# EAGLE design L293D Module (EAGLE 9.6.2)
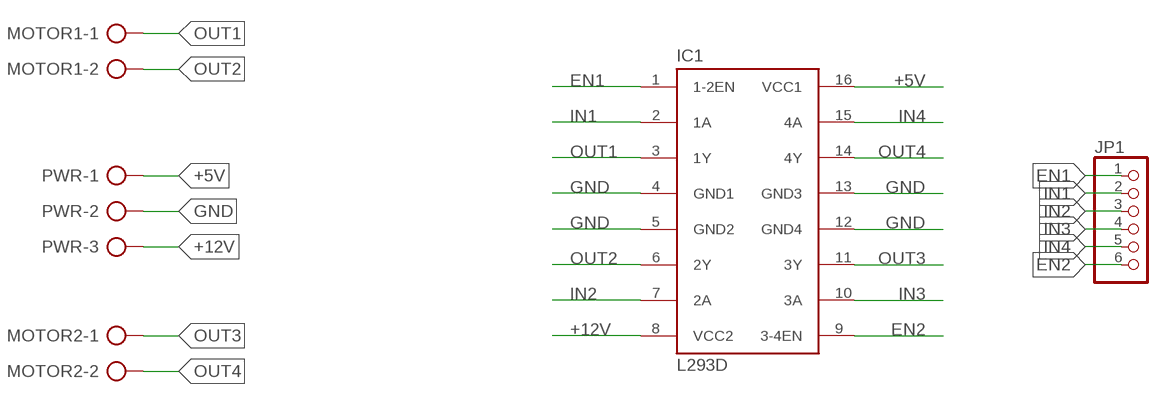
[diagram p0: schematic, sheet 1]

## Parts
IC1  L293D  [DIL16]
JP1  PINHD-1X6  [1X06]
MOTOR1  AK500/2-H  [AK500/2-H]
MOTOR2  AK500/2-H  [AK500/2-H]
PWR  AK500/3-H  [AK500/3-H]

## Nets
+5V: IC1.16(VCC1) PWR.1
+12V: IC1.8(VCC2) PWR.3
EN1: IC1.1(1-2EN) JP1.1
EN2: IC1.9(3-4EN) JP1.6
GND: IC1.4(GND1) IC1.5(GND2) IC1.12(GND4) IC1.13(GND3) PWR.2
IN1: IC1.2(1A) JP1.2
IN2: IC1.7(2A) JP1.3
IN3: IC1.10(3A) JP1.4
IN4: IC1.15(4A) JP1.5
OUT1: IC1.3(1Y) MOTOR1.1
OUT2: IC1.6(2Y) MOTOR1.2
OUT3: IC1.11(3Y) MOTOR2.1
OUT4: IC1.14(4Y) MOTOR2.2

## Library data of the parts
IC1 = st-microelectronics:L293D: PUSH-PULL 4 CHANNEL DRIVER; MPN: L293D; OC_FARNELL: 9589619; OC_NEWARK: 56P8249
JP1 = pinhead:PINHD-1X6: PIN HEADER
MOTOR1 MOTOR2 = con-ptr500:AK500/2-H: CONNECTOR Aug. 2004 / PTR Meßtechnik: Die Bezeichnung der Serie AK505 wurde geändert. Es handelt sich hierbei um AK500 in horizontaler Ausführung.; OC_FARNELL: unknown; OC_NEWARK: unknown
PWR = con-ptr500:AK500/3-H: CONNECTOR Aug. 2004 / PTR Meßtechnik: Die Bezeichnung der Serie AK505 wurde geändert. Es handelt sich hierbei um AK500 in horizontaler Ausführung.; OC_FARNELL: unknown; OC_NEWARK: unknown

## Board
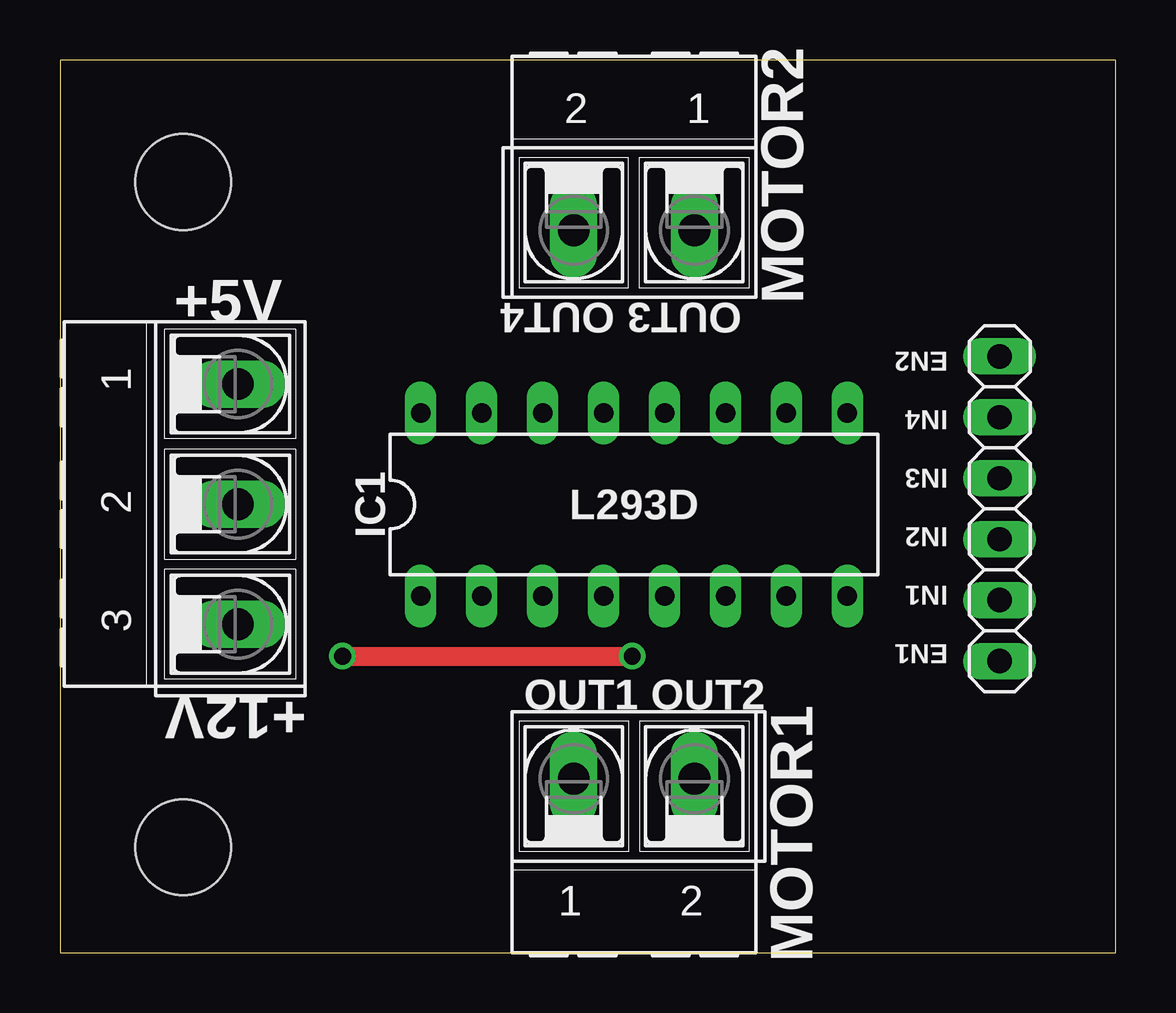
[diagram p1: board, top side]
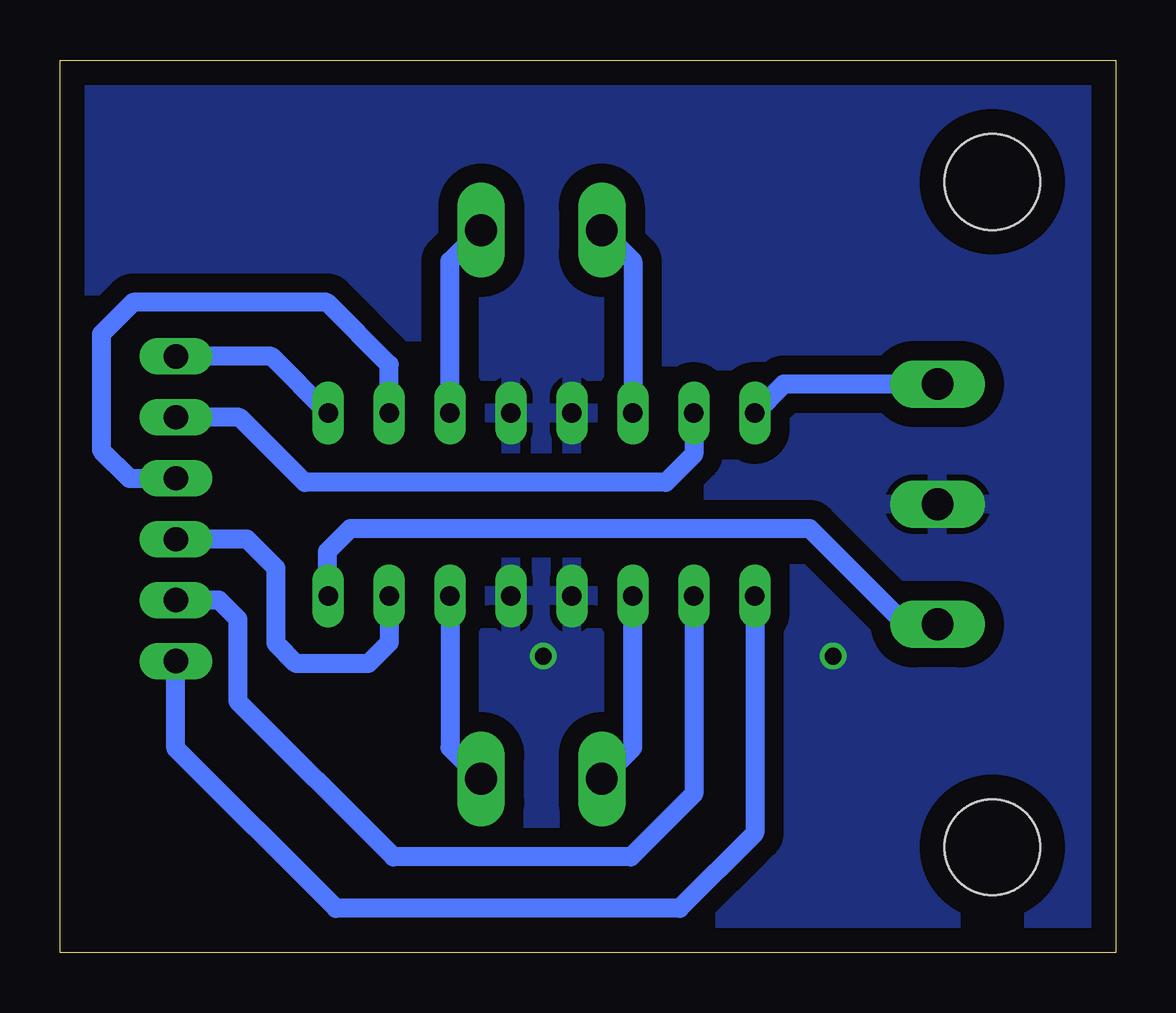
[diagram p2: board, bottom side, seen from below]

Size 44 x 37.2 mm. Coordinates in mm from the lower left corner, seen from the top.
Outline: 0,0 44,0 44,37.2 0,37.2 0,0
Copper layers (1*16): Top 0.035mm / dielectric 1.5mm / Bottom 0.035mm
Design rules "default *": minimum track width 0.8mm, minimum drill 0.7mm, track to track 0.6mm, track to pad 0.6mm, pad to pad 0.6mm, via to via 0.6mm, smd to smd 0.6mm, copper to edge 40mil, drill to drill 6mil, minimum pad ring 10mil, minimum via ring 8mil, stop-mask expansion 4mil, vias tented up to drill 0mil, thermal gap 10mil
Holes 4 mm at 5.13,32.12 5.13,4.4

### Footprints (pad centres in the part's own frame; a part is rotated, then mirrored left to right if it is on the bottom)
DIL16 = drill 0.813 long: 1 -8.89,-3.81; 2 -6.35,-3.81; 3 -3.81,-3.81; 4 -1.27,-3.81; 5 1.27,-3.81; 6 3.81,-3.81; 7 6.35,-3.81; 8 8.89,-3.81; 9 8.89,3.81; 10 6.35,3.81; 11 3.81,3.81; 12 1.27,3.81; 13 -1.27,3.81; 14 -3.81,3.81; 15 -6.35,3.81; 16 -8.89,3.81
1X06 = drill 1.016 long: 1 -6.35,0; 2 -3.81,0; 3 -1.27,0; 4 1.27,0; 5 3.81,0; 6 6.35,0
AK500/2-H = drill 1.321 long: 1 -2.515,0; 2 2.515,0
AK500/3-H = drill 1.321 long: 1 -5.004,0; 2 0,0; 3 5.004,0

### Placement (x,y rotation side)
IC1  23.93,18.68 0 top
JP1  39.17,18.5 90 top
MOTOR1  23.93,7.25 0 top
MOTOR2  23.93,30.11 180 top
PWR  7.42,18.69 270 top

### Tracks (layer width: path | path; a pad name or v marks a point on that pad's centre or on a via)
+5V
  Bottom 0.8: PWR.1 13.83,23.7 IC1.16
+12V
  Bottom 0.8: PWR.3 8.76,13.69 12.75,17.68 31.9,17.68 32.85,16.73 32.85,14.9 IC1.8
EN1
  Bottom 0.8: IC1.1 15.04,4.99 18.18,1.85 32.5,1.85 39.17,8.52 JP1.1
EN2
  Bottom 0.8: IC1.9 35.18,24.85 JP1.6
GND  (via drill 0.7)
  Top 0.8: v11.78,12.36 v23.85,12.36
  pour Bottom (isolate 0.8): -5.47,52.9 56.52,52.9 56.52,-2.88 -5.47,-2.88
IN1
  Bottom 0.8: IC1.2 17.58,6.62 20.2,4 30.1,4 36.59,10.49 36.59,13.91 37.37,14.69 JP1.2
IN2
  Bottom 0.8: IC1.7 30.28,12.92 31.15,12.05 34.15,12.05 35,12.9 35,16.02 36.21,17.23 JP1.3
IN3
  Bottom 0.8: IC1.10 30.28,24.5 32.88,27.1 40.95,27.1 42.27,25.77 42.27,20.95 41.1,19.77 JP1.4
IN4
  Bottom 0.8: IC1.15 17.58,20.77 18.75,19.6 33.8,19.6 36.51,22.31 JP1.5
OUT1
  Bottom 0.8: MOTOR1.1 20.12,8.54 IC1.3
OUT2
  Bottom 0.8: IC1.6 27.74,8.54 MOTOR1.2
OUT3
  Bottom 0.8: IC1.11 27.74,28.82 MOTOR2.1
OUT4
  Bottom 0.8: MOTOR2.2 20.12,28.82 IC1.14

### Text on the board
tNames: OUT3 OUT4 | +5V | EN1 / / IN1 / / IN2 / / IN3 / / IN4 / / EN2 | +12V | OUT1 OUT2